# EAGLE design windVane (EAGLE 7.3.0)
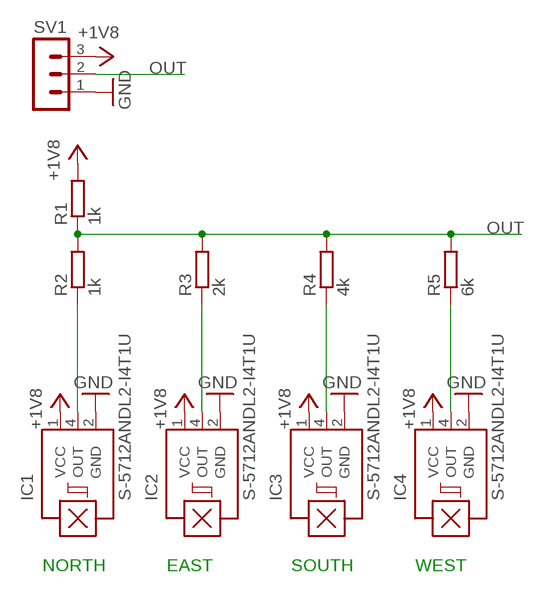
[diagram p0: schematic, sheet 1]

## Parts
IC1  S-5712ANDL2-I4T1U  [SNT-4A]
IC2  S-5712ANDL2-I4T1U  [SNT-4A]
IC3  S-5712ANDL2-I4T1U  [SNT-4A]
IC4  S-5712ANDL2-I4T1U  [SNT-4A]
R1  1k  R-EU_M1206  [M1206]
R2  1k  R-EU_M1206  [M1206]
R3  2k  R-EU_M1206  [M1206]
R4  4k  R-EU_M1206  [M1206]
R5  6k  R-EU_M1206  [M1206]
SV1  MA03-1  [MA03-1]

## Nets
+1V8: IC1.1(VCC) IC2.1(VCC) IC3.1(VCC) IC4.1(VCC) R1.2 SV1.3
GND: IC1.2(GND) IC2.2(GND) IC3.2(GND) IC4.2(GND) SV1.1
N$1: IC2.4(OUT) R3.1
N$2: IC3.4(OUT) R4.1
N$3: IC4.4(OUT) R5.1
N$5: IC1.4(OUT) R2.1
OUT: R1.1 R2.2 R3.2 R4.2 R5.2 SV1.2

## Notes on the sheet
- NORTH | EAST | SOUTH | WEST

## Library data of the parts
IC1-IC4 = ulf:S-5712ANDL2-I4T1U
R1-R5 = rcl:R-EU_: RESISTOR, European symbol
SV1 = con-lstb:MA03-1: PIN HEADER; OC_FARNELL: unknown; OC_NEWARK: unknown

## Board
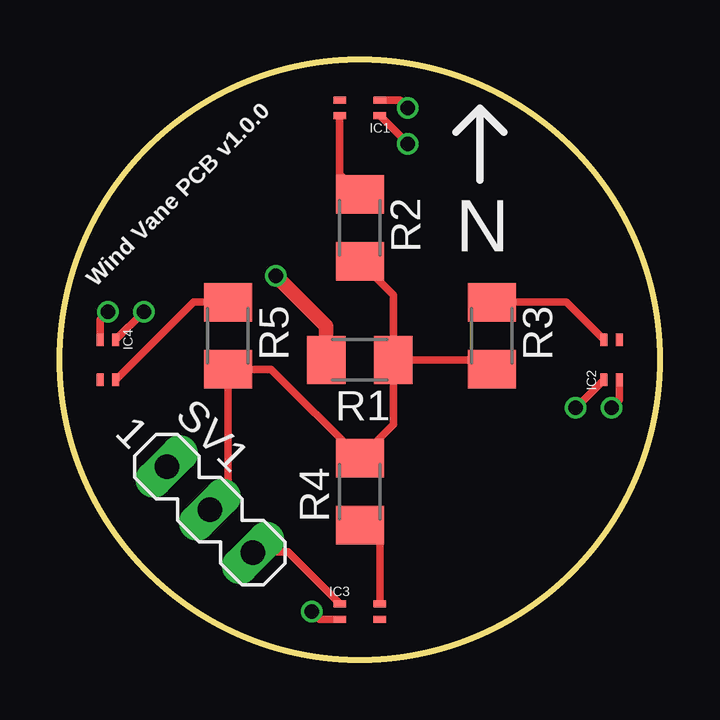
[diagram p1: board, top side]
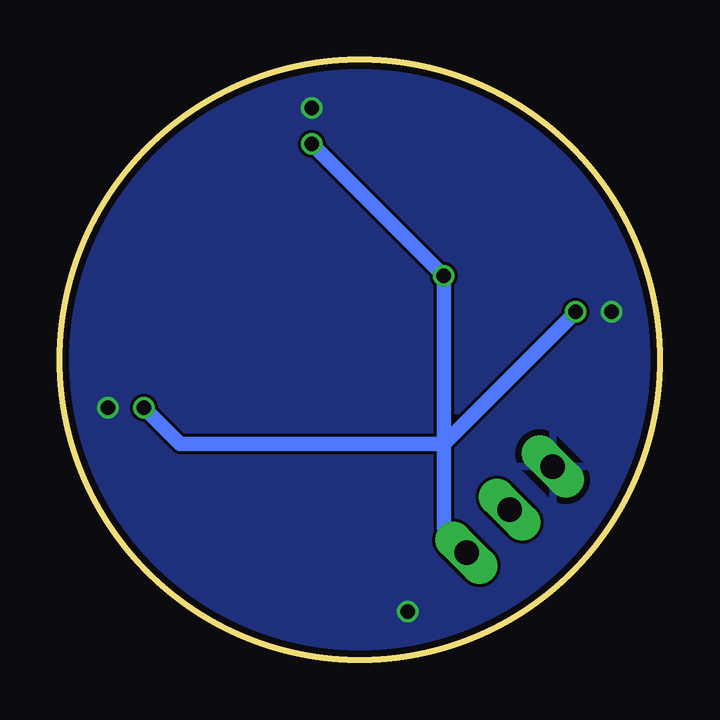
[diagram p2: board, bottom side, seen from below]

Size 25 x 25 mm. Coordinates in mm from the lower left corner, seen from the top.
Outline: circle at 12.5,12.5 radius 12.5
Copper layers (1*16): Top 0.035mm / dielectric 1.5mm / Bottom 0.035mm
Design rules "dirt_cheap_dirty_boards.v1": minimum track width 5mil, minimum drill 12mil, track to track 5mil, track to pad 5mil, pad to pad 5mil, via to via 5mil, smd to smd 0mil, copper to edge 10mil, drill to drill 10mil, minimum pad ring 10mil, minimum via ring 6mil, stop-mask expansion 2mil, vias tented up to drill 25mil, thermal gap 10mil

### Footprints (pad centres in the part's own frame; a part is rotated, then mirrored left to right if it is on the bottom)
SNT-4A = smd 0.52 x 0.3: 1 -0.84,0.325; 2 -0.84,-0.325; 3 0.84,-0.325; 4 0.84,0.325
M1206 = smd 1.6 x 2: 1 -1.4,0; 2 1.4,0
MA03-1 = drill 1.016 long: 1 -2.54,0; 2 0,0; 3 2.54,0

### Placement (x,y rotation side)
IC1  12.5,23 180 top
IC2  23,12.5 90 top
IC3  12.5,2 0 top
IC4  2,12.5 270 top
R1  12.5,12.5 180 top
R2  12.5,18 270 top
R3  18,13.5 270 top
R4  12.5,7 90 top
R5  7,13.5 270 top
SV1  6.25,6.25 315 top

### Tracks (layer width: path | path; a pad name or v marks a point on that pad's centre or on a via)
+1V8  (via drill 0.6)
  Top 0.305: IC3.1 9.5,4.5 8.09,4.5 SV1.3 | IC4.1 3.48,14.5 v3.5,14.5 | IC1.1 14.5,21.52 v14.5,21.5 | IC2.1 21.52,10.5 v21.5,10.5
  Top 0.61: v9,16 11.1,13.9 R1.2
  Bottom 0.61: v3.5,14.5 9,9 | 9,9 9,5.5 8.05,4.55 SV1.3 | v14.5,21.5 v9,16 9,9 | v21.5,10.5 20,9 9,9
GND  (via drill 0.6)
  Top 0.305: IC4.2 1.68,14.18 v2,14.5 | IC2.2 23.32,10.82 v23,10.5 | IC1.2 14.18,23.32 v14.5,23 | IC3.2 10.82,1.68 v10.5,2
  pour Bottom: 12.5,25 arc90 0,12.5 arc90 12.5,0 arc90 25,12.5 arc90
N$1
  Top 0.305: IC2.4 21.11,14.9 R3.1
N$2
  Top 0.305: IC3.4 13.34,5.6 R4.1
N$3
  Top 0.305: IC4.4 5.57,14.9 R5.1
N$5
  Top 0.305: IC1.4 11.66,20.24 R2.1
OUT
  Top 0.305: R2.2 13.9,15.2 R1.1 | R3.2 17.6,12.5 R1.1 | R1.1 13.9,9.8 R4.2 8.8,12.1 R5.2 7,7 SV1.2

### Text on the board
tPlace: N | Wind Vane PCB v1.0.0